# Altium schematic sheet Rp2040.SchDoc
size A4; SheetNumber: 2; SheetTotal: 6
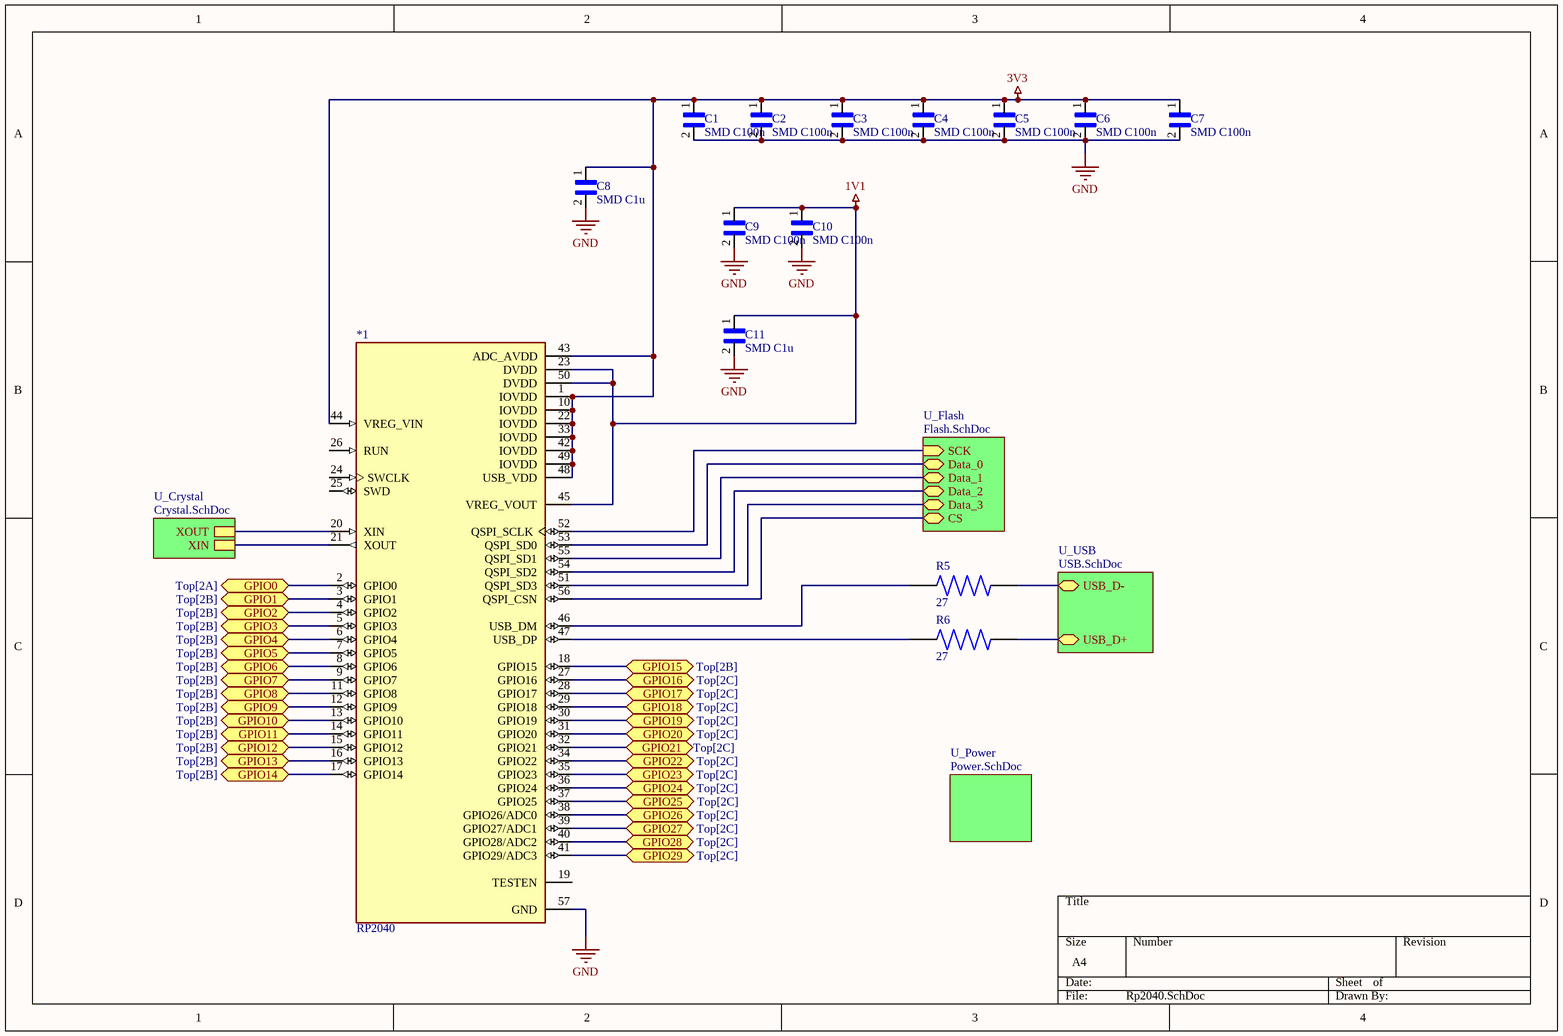
[diagram p0: Rp2040.SchDoc]

## Parts
*1  RP2040  [RP2040-Footprint-1]
C1  SMD C100n  [SMD Capacetor-Footprint-1]
C2  SMD C100n  [SMD Capacetor-Footprint-1]
C3  SMD C100n  [SMD Capacetor-Footprint-1]
C4  SMD C100n  [SMD Capacetor-Footprint-1]
C5  SMD C100n  [SMD Capacetor-Footprint-1]
C6  SMD C100n  [SMD Capacetor-Footprint-1]
C7  SMD C100n  [SMD Capacetor-Footprint-1]
C8  SMD C1u  [SMD Capacetor-Footprint-1]
C9  SMD C100n  [SMD Capacetor-Footprint-1]
C10  SMD C100n  [SMD Capacetor-Footprint-1]
C11  SMD C1u  [SMD Capacetor-Footprint-1]
R5  27  [SMD Resistor-Footprint-1]
R6  27  [SMD Resistor-Footprint-1]

## Sub-sheets
U_Crystal = Crystal.SchDoc: XIN, XOUT
U_Flash = Flash.SchDoc: SCK (in), Data_0 (bidir), Data_1 (bidir), Data_2 (bidir), Data_3 (bidir), CS (bidir)
U_Power = Power.SchDoc: no entries
U_USB = USB.SchDoc: USB_D+ (bidir), USB_D- (bidir)

## Ports
GPIO0 (bidir, see Top[2A]), GPIO1 (bidir, see Top[2B]), GPIO2 (bidir, see Top[2B]), GPIO3 (bidir, see Top[2B]), GPIO4 (bidir, see Top[2B]), GPIO5 (bidir, see Top[2B]), GPIO6 (bidir, see Top[2B]), GPIO7 (bidir, see Top[2B]), GPIO8 (bidir, see Top[2B]), GPIO9 (bidir, see Top[2B]), GPIO10 (bidir, see Top[2B]), GPIO11 (bidir, see Top[2B]), GPIO12 (bidir, see Top[2B]), GPIO13 (bidir, see Top[2B]), GPIO14 (bidir, see Top[2B]), GPIO15 (bidir, see Top[2B]), GPIO16 (bidir, see Top[2C]), GPIO17 (bidir, see Top[2C]), GPIO18 (bidir, see Top[2C]), GPIO19 (bidir, see Top[2C]), GPIO20 (bidir, see Top[2C]), GPIO21 (bidir, see Top[2C]), GPIO22 (bidir, see Top[2C]), GPIO23 (bidir, see Top[2C]), GPIO24 (bidir, see Top[2C]), GPIO25 (bidir, see Top[2C]), GPIO26 (bidir, see Top[2C]), GPIO27 (bidir, see Top[2C]), GPIO28 (bidir, see Top[2C]), GPIO29 (bidir, see Top[2C])

## Nets
1V1: *1.23(DVDD) *1.45(VREG_VOUT) *1.50(DVDD) C9.1 C10.1 C11.1
3V3: *1.1(IOVDD) *1.10(IOVDD) *1.22(IOVDD) *1.33(IOVDD) *1.42(IOVDD) *1.43(ADC_AVDD) *1.44(VREG_VIN) *1.48(USB_VDD) *1.49(IOVDD) C1.1 C2.1 C3.1 C4.1 C5.1 C6.1 C7.1 C8.1
GND: *1.57(GND) C1.2 C2.2 C3.2 C4.2 C5.2 C6.2 C7.2 C8.2 C9.2 C10.2 C11.2
GPIO0: *1.2(GPIO0) ; port GPIO0
GPIO1: *1.3(GPIO1) ; port GPIO1
GPIO2: *1.4(GPIO2) ; port GPIO2
GPIO3: *1.5(GPIO3) ; port GPIO3
GPIO4: *1.6(GPIO4) ; port GPIO4
GPIO5: *1.7(GPIO5) ; port GPIO5
GPIO6: *1.8(GPIO6) ; port GPIO6
GPIO7: *1.9(GPIO7) ; port GPIO7
GPIO8: *1.11(GPIO8) ; port GPIO8
GPIO9: *1.12(GPIO9) ; port GPIO9
GPIO10: *1.13(GPIO10) ; port GPIO10
GPIO11: *1.14(GPIO11) ; port GPIO11
GPIO12: *1.15(GPIO12) ; port GPIO12
GPIO13: *1.16(GPIO13) ; port GPIO13
GPIO14: *1.17(GPIO14) ; port GPIO14
GPIO15: *1.18(GPIO15) ; port GPIO15
GPIO16: *1.27(GPIO16) ; port GPIO16
GPIO17: *1.28(GPIO17) ; port GPIO17
GPIO18: *1.29(GPIO18) ; port GPIO18
GPIO19: *1.30(GPIO19) ; port GPIO19
GPIO20: *1.31(GPIO20) ; port GPIO20
GPIO21: *1.32(GPIO21) ; port GPIO21
GPIO22: *1.34(GPIO22) ; port GPIO22
GPIO23: *1.35(GPIO23) ; port GPIO23
GPIO24: *1.36(GPIO24) ; port GPIO24
GPIO25: *1.37(GPIO25) ; port GPIO25
GPIO26: *1.38(GPIO26/ADC0) ; port GPIO26
GPIO27: *1.39(GPIO27/ADC1) ; port GPIO27
GPIO28: *1.40(GPIO28/ADC2) ; port GPIO28
GPIO29: *1.41(GPIO29/ADC3) ; port GPIO29
Net*1_20: *1.20(XIN) ; sheet U_Crystal/XOUT
Net*1_21: *1.21(XOUT) ; sheet U_Crystal/XIN
Net*1_46: *1.46(USB_DM) R5.1
Net*1_47: *1.47(USB_DP) R6.1
Net*1_51: *1.51(QSPI_SD3) ; sheet U_Flash/Data_3
Net*1_52: *1.52(QSPI_SCLK) ; sheet U_Flash/SCK
Net*1_53: *1.53(QSPI_SD0) ; sheet U_Flash/Data_0
Net*1_54: *1.54(QSPI_SD2) ; sheet U_Flash/Data_2
Net*1_55: *1.55(QSPI_SD1) ; sheet U_Flash/Data_1
Net*1_56: *1.56(QSPI_CSN) ; sheet U_Flash/CS
NetR5_2: R5.2 ; sheet U_USB/USB_D-
NetR6_2: R6.2 ; sheet U_USB/USB_D+

Not connected (* = marked no-connect by the designer): *1 19(TESTEN) 24(SWCLK) 25(SWD) 26(RUN)

## Library data of the parts
*1 = CMP-00016-1: Microprocessor
C1-C7 C9 C10 = CMP-00017-4: Generic SMD Capacetor
C8 C11 = CMP-00052-1: Generic SMD Capacetor
R5 R6 = CMP-00019-4: Generic SMD Resistor